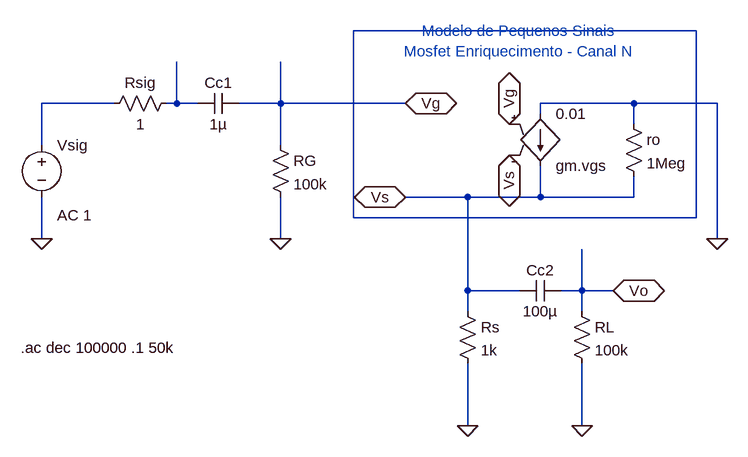
[diagram p0: schematic Dreno_Comum_Baixas_Frequencias.asc]
Dreno_Comum_Baixas_Frequencias.asc, the LTspice schematic file:
Version 4
SHEET 1 1560 680
WIRE 1040 -32 512 -32
WIRE 144 80 32 80
WIRE 240 80 240 16
WIRE 240 80 224 80
WIRE 272 80 240 80
WIRE 400 80 400 16
WIRE 400 80 336 80
WIRE 592 80 400 80
WIRE 944 80 800 80
WIRE 1072 80 944 80
WIRE 800 96 800 80
WIRE 944 112 944 80
WIRE 32 144 32 80
WIRE 400 144 400 80
WIRE 688 224 592 224
WIRE 800 224 800 176
WIRE 800 224 688 224
WIRE 944 224 944 192
WIRE 944 224 800 224
WIRE 512 256 512 -32
WIRE 1040 256 1040 -32
WIRE 1040 256 512 256
WIRE 32 288 32 224
WIRE 400 288 400 224
WIRE 1072 288 1072 80
WIRE 688 368 688 224
WIRE 768 368 688 368
WIRE 864 368 864 304
WIRE 864 368 832 368
WIRE 912 368 864 368
WIRE 688 400 688 368
WIRE 864 400 864 368
WIRE 688 576 688 480
WIRE 864 576 864 480
FLAG 32 288 0
FLAG 400 288 0
FLAG 752 112 Vg
IOPIN 752 112 BiDir
FLAG 752 160 Vs
IOPIN 752 160 BiDir
FLAG 592 80 Vg
IOPIN 592 80 BiDir
FLAG 592 224 Vs
IOPIN 592 224 BiDir
FLAG 1072 288 0
FLAG 688 576 0
FLAG 912 368 Vo
IOPIN 912 368 BiDir
FLAG 864 576 0
SYMBOL voltage 32 128 R0
WINDOW 123 24 124 Left 2
WINDOW 39 0 0 Left 0
SYMATTR Value2 AC 1
SYMATTR InstName Vsig
SYMATTR Value ""
SYMBOL res 240 64 R90
WINDOW 0 0 56 VBottom 2
WINDOW 3 32 56 VTop 2
SYMATTR InstName Rsig
SYMATTR Value 1
SYMBOL cap 336 64 R90
WINDOW 0 0 32 VBottom 2
WINDOW 3 32 32 VTop 2
SYMATTR InstName Cc1
SYMATTR Value 1µ
SYMBOL res 384 128 R0
SYMATTR InstName RG
SYMATTR Value 100k
SYMBOL res 672 384 R0
SYMATTR InstName Rs
SYMATTR Value 1k
SYMBOL res 928 96 R0
SYMATTR InstName ro
SYMATTR Value 1Meg
SYMBOL g2 800 192 M180
SYMATTR InstName gm.vgs
SYMATTR Value 0.01
SYMBOL cap 832 352 R90
WINDOW 0 0 32 VBottom 2
WINDOW 3 32 32 VTop 2
SYMATTR InstName Cc2
SYMATTR Value 100µ
SYMBOL res 848 384 R0
SYMATTR InstName RL
SYMATTR Value 100k
TEXT 0 456 Left 2 !.ac dec 100000 .1 50k
TEXT 768 -16 Center 2 ;Modelo de Pequenos Sinais\nMosfet Enriquecimento - Canal N

The netlist it stands for:
* Dreno_Comum_Baixas_Frequencias.asc
Vsig N002 0 AC 1
Rsig N003 N002 1
Cc1 Vg N003 1µ
RG Vg 0 100k
Rs Vs 0 1k
ro 0 Vs 1Meg
gm.vgs 0 Vs Vg Vs 0.01
Cc2 Vo Vs 100µ
RL Vo 0 100k
.ac dec 100000 .1 50k
* Modelo de Pequenos Sinais
* Mosfet Enriquecimento - Canal N
.backanno
.end